# Altium schematic sheet GainDrain.SchDoc
size A3; SheetNumber: 1; SheetTotal: 1
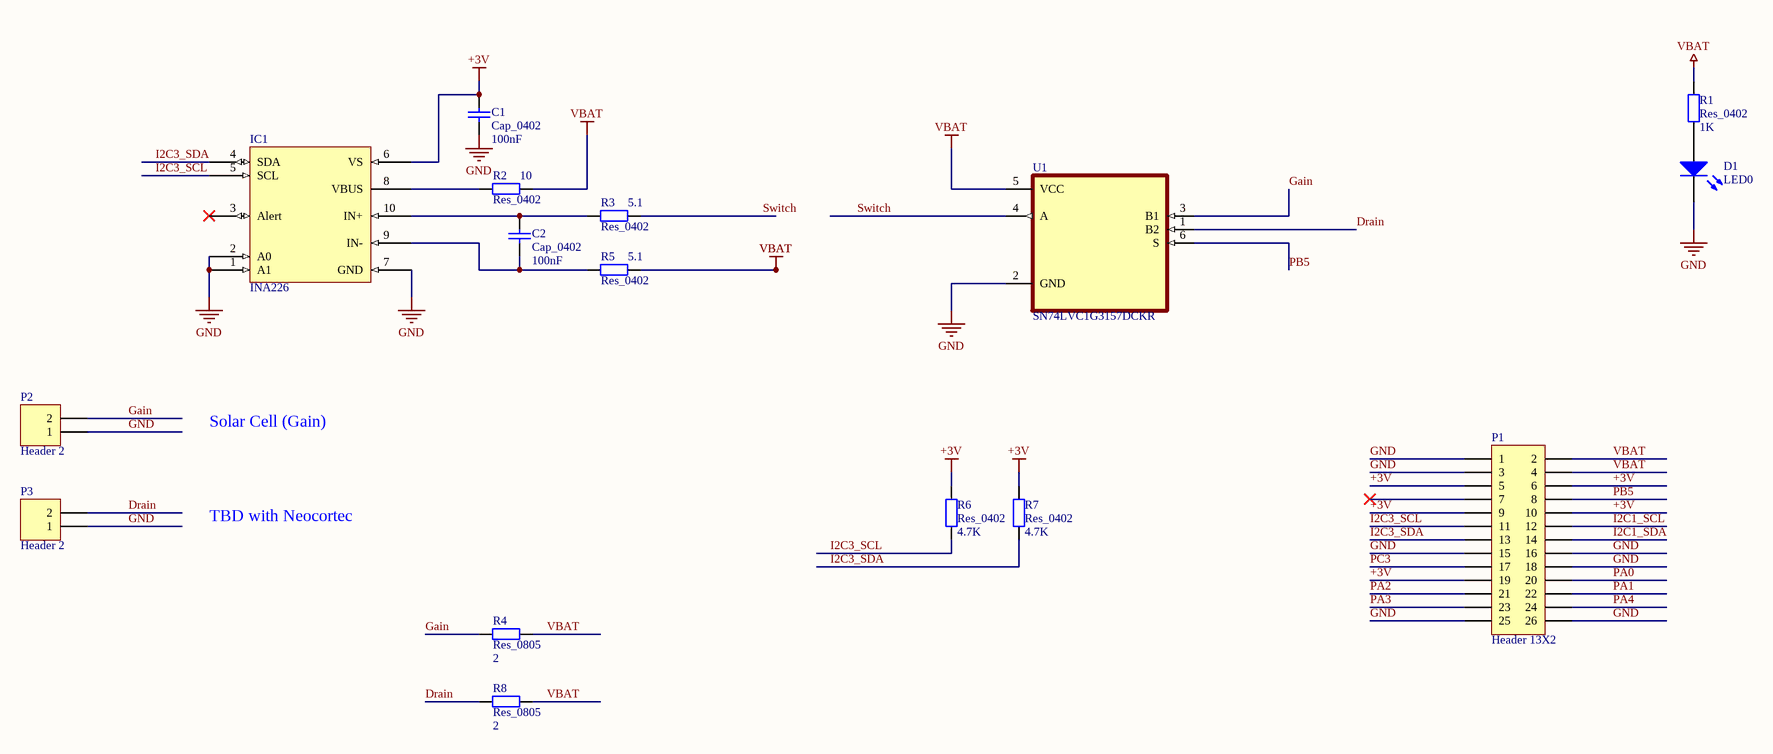
[diagram p0: GainDrain.SchDoc]

## Parts
C1  Cap_0402  value 100nF  [0402]
C2  Cap_0402  value 100nF  [0402]
D1  LED0  [0603]
IC1  INA226  [VSSOP-10]
P1  Header 13X2  [HDR2X13]
P2  Header 2  [HDR1X2]
P3  Header 2  [HDR1X2]
R1  Res_0402  value 1K  [0402]
R2  Res_0402  value 10  [0402]
R3  Res_0402  value 5.1  [0402]
R4  Res_0805  value 2  [0805]
R5  Res_0402  value 5.1  [0402]
R6  Res_0402  value 4.7K  [0402]
R7  Res_0402  value 4.7K  [0402]
R8  Res_0805  value 2  [0805]
U1  SN74LVC1G3157DCKR  [SOT65P210X110-6N]

## Nets
+3V: C1.2 IC1.6(VS) P1.5 P1.6 P1.9 P1.10 P1.19 R6.2 R7.2
GND: C1.1 D1.1(K) IC1.1(A1) IC1.2(A0) IC1.7(GND) P1.1 P1.3 P1.15 P1.16 P1.18 P1.25 P1.26 P2.1 P3.1 U1.2(GND)
VBAT: P1.2 P1.4 R1.2 R2.2 R4.1 R5.2 R8.1 U1.5(VCC)
Drain: P3.2 R8.2 U1.1(B2)
Gain: P2.2 R4.2 U1.3(B1)
I2C1_SCL: P1.12
I2C1_SDA: P1.14
I2C3_SCL: IC1.5(SCL) P1.11 R6.1
I2C3_SDA: IC1.4(SDA) P1.13 R7.1
PA0: P1.20
PA1: P1.22
PA2: P1.21
PA3: P1.23
PA4: P1.24
PB5: P1.8 U1.6(S)
PC3: P1.17
Switch: R3.2 U1.4(A)
NetC2_1: C2.1 IC1.9(IN-) R5.1
NetC2_2: C2.2 IC1.10(IN+) R3.1
NetD1_2: D1.2(A) R1.1
NetIC1_8: IC1.8(VBUS) R2.1

Not connected (* = marked no-connect by the designer): IC1 3(Alert)*; P1 7*

## Notes on the sheet
- Solar Cell (Gain)
- TBD with Neocortec

## Library data of the parts
C1 C2 = Cap_0402: Capacitor; Published: 8-Jun-2000; LatestRevisionDate: 17-Jul-2002; LatestRevisionNote: Re-released for DXP Platform.; PackageReference: RAD-0.3; Publisher: Altium Limited; PackageDescription: Radial Cap, Thru-Hole; 2 Leads; 0.3 in Pin Spacing
D1 = LED0: Typical INFRARED GaAs LED; Published: 8-Jun-2000; LatestRevisionDate: 08-Jul-2005; LatestRevisionNote: Mech Layer 1 removed.; PackageReference: LED-0; Publisher: Altium Limited; PackageDescription: LED; 2 Leads
IC1 = INA226: Bi-Directional Current and Power Monitor
P1 = Header 13X2: Header, 13-Pin, Dual row; LatestRevisionDate: 17-Jul-2002; LatestRevisionNote: Re-released for DXP Platform.; Publisher: Altium Limited
P2 P3 = Header 2: Header, 2-Pin; LatestRevisionDate: 17-Jul-2002; LatestRevisionNote: Re-released for DXP Platform.; Publisher: Altium Limited
R1-R3 R5-R7 = Res_0402: Resistor; Published: 8-Jun-2000; LatestRevisionDate: 17-Jul-2002; LatestRevisionNote: Re-released for DXP Platform.; PackageReference: AXIAL-0.4; Publisher: Altium Limited; PackageDescription: Axial Device, Thru-Hole; 2 Leads; 0.4 in Pin Spacing
R4 R8 = Res_0805: Resistor; Published: 8-Jun-2000; LatestRevisionDate: 17-Jul-2002; LatestRevisionNote: Re-released for DXP Platform.; PackageReference: AXIAL-0.4; Publisher: Altium Limited; PackageDescription: Axial Device, Thru-Hole; 2 Leads; 0.4 in Pin Spacing
U1 = SN74LVC1G3157DCKR: 5 Vï¼Œ2ï¼š1ï¼ˆSPDTï¼‰ï¼Œ1é€šé“é€šç”¨æ¨¡æ“¬é–‹é—œ6-SC70 -40è‡³125; MF: Texas Instruments; Availability: Good; SnapEDA_Link: https://www.snapeda.com/parts/SN74LVC1G3157DCKR/Texas%20Instruments/view-part/270736/?ref=snap; Check_prices: https://www.snapeda.com/parts/SN74LVC1G3157DCKR/Texas%20Instruments/view-part/270736/?ref=eda; Value: *; Package: SOT-SC70-6 Texas Instruments; Purchase-URL: https://pricing.snapeda.com/search/part/SN74LVC1G3157DCKR/?ref=eda; MP: SN74LVC1G3157DCKR; Price: None